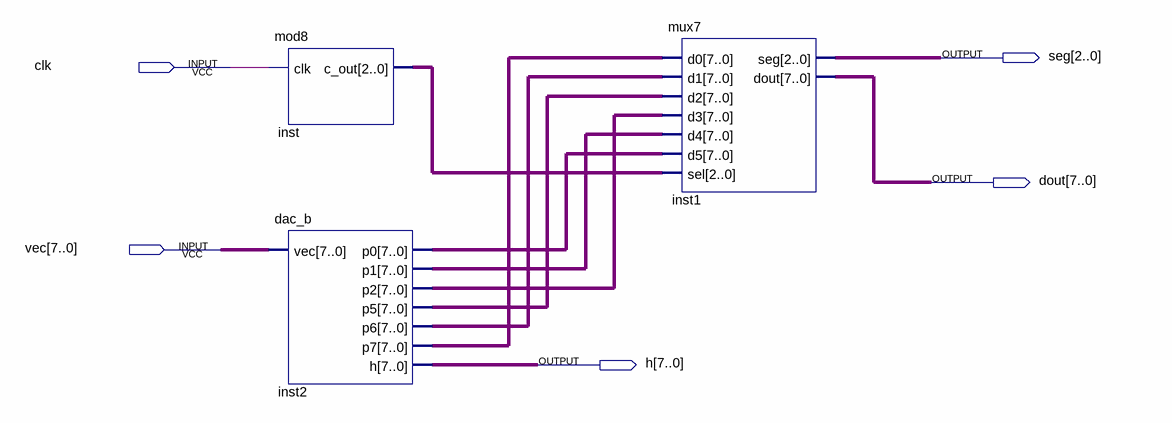
[diagram p0: schematic sheet]
// Quartus schematic base.bdf as structural Verilog: 3 symbols, 5 pins
module base (
  input  clk,
  input  [7:0] vec,
  output [2:0] seg,
  output [7:0] dout,
  output [7:0] h
);

  wire [2:0] inst_c_out;
  wire [7:0] inst2_p0, inst2_p1, inst2_p2, inst2_p5, inst2_p6, inst2_p7;

  mod8 inst (.clk(clk), .c_out(inst_c_out));
  dac_b inst2 (
    .vec(vec), .p0(inst2_p0), .p1(inst2_p1), .p2(inst2_p2), .p5(inst2_p5), .p6(inst2_p6), .p7(inst2_p7), .h(h));
  mux7 inst1 (
    .d0(inst2_p7), .d1(inst2_p6), .d2(inst2_p5), .d3(inst2_p2), .d4(inst2_p1), .d5(inst2_p0),
    .sel(inst_c_out), .seg(seg), .dout(dout));
endmodule
